# EAGLE design motorcomp (EAGLE 6.6.0)
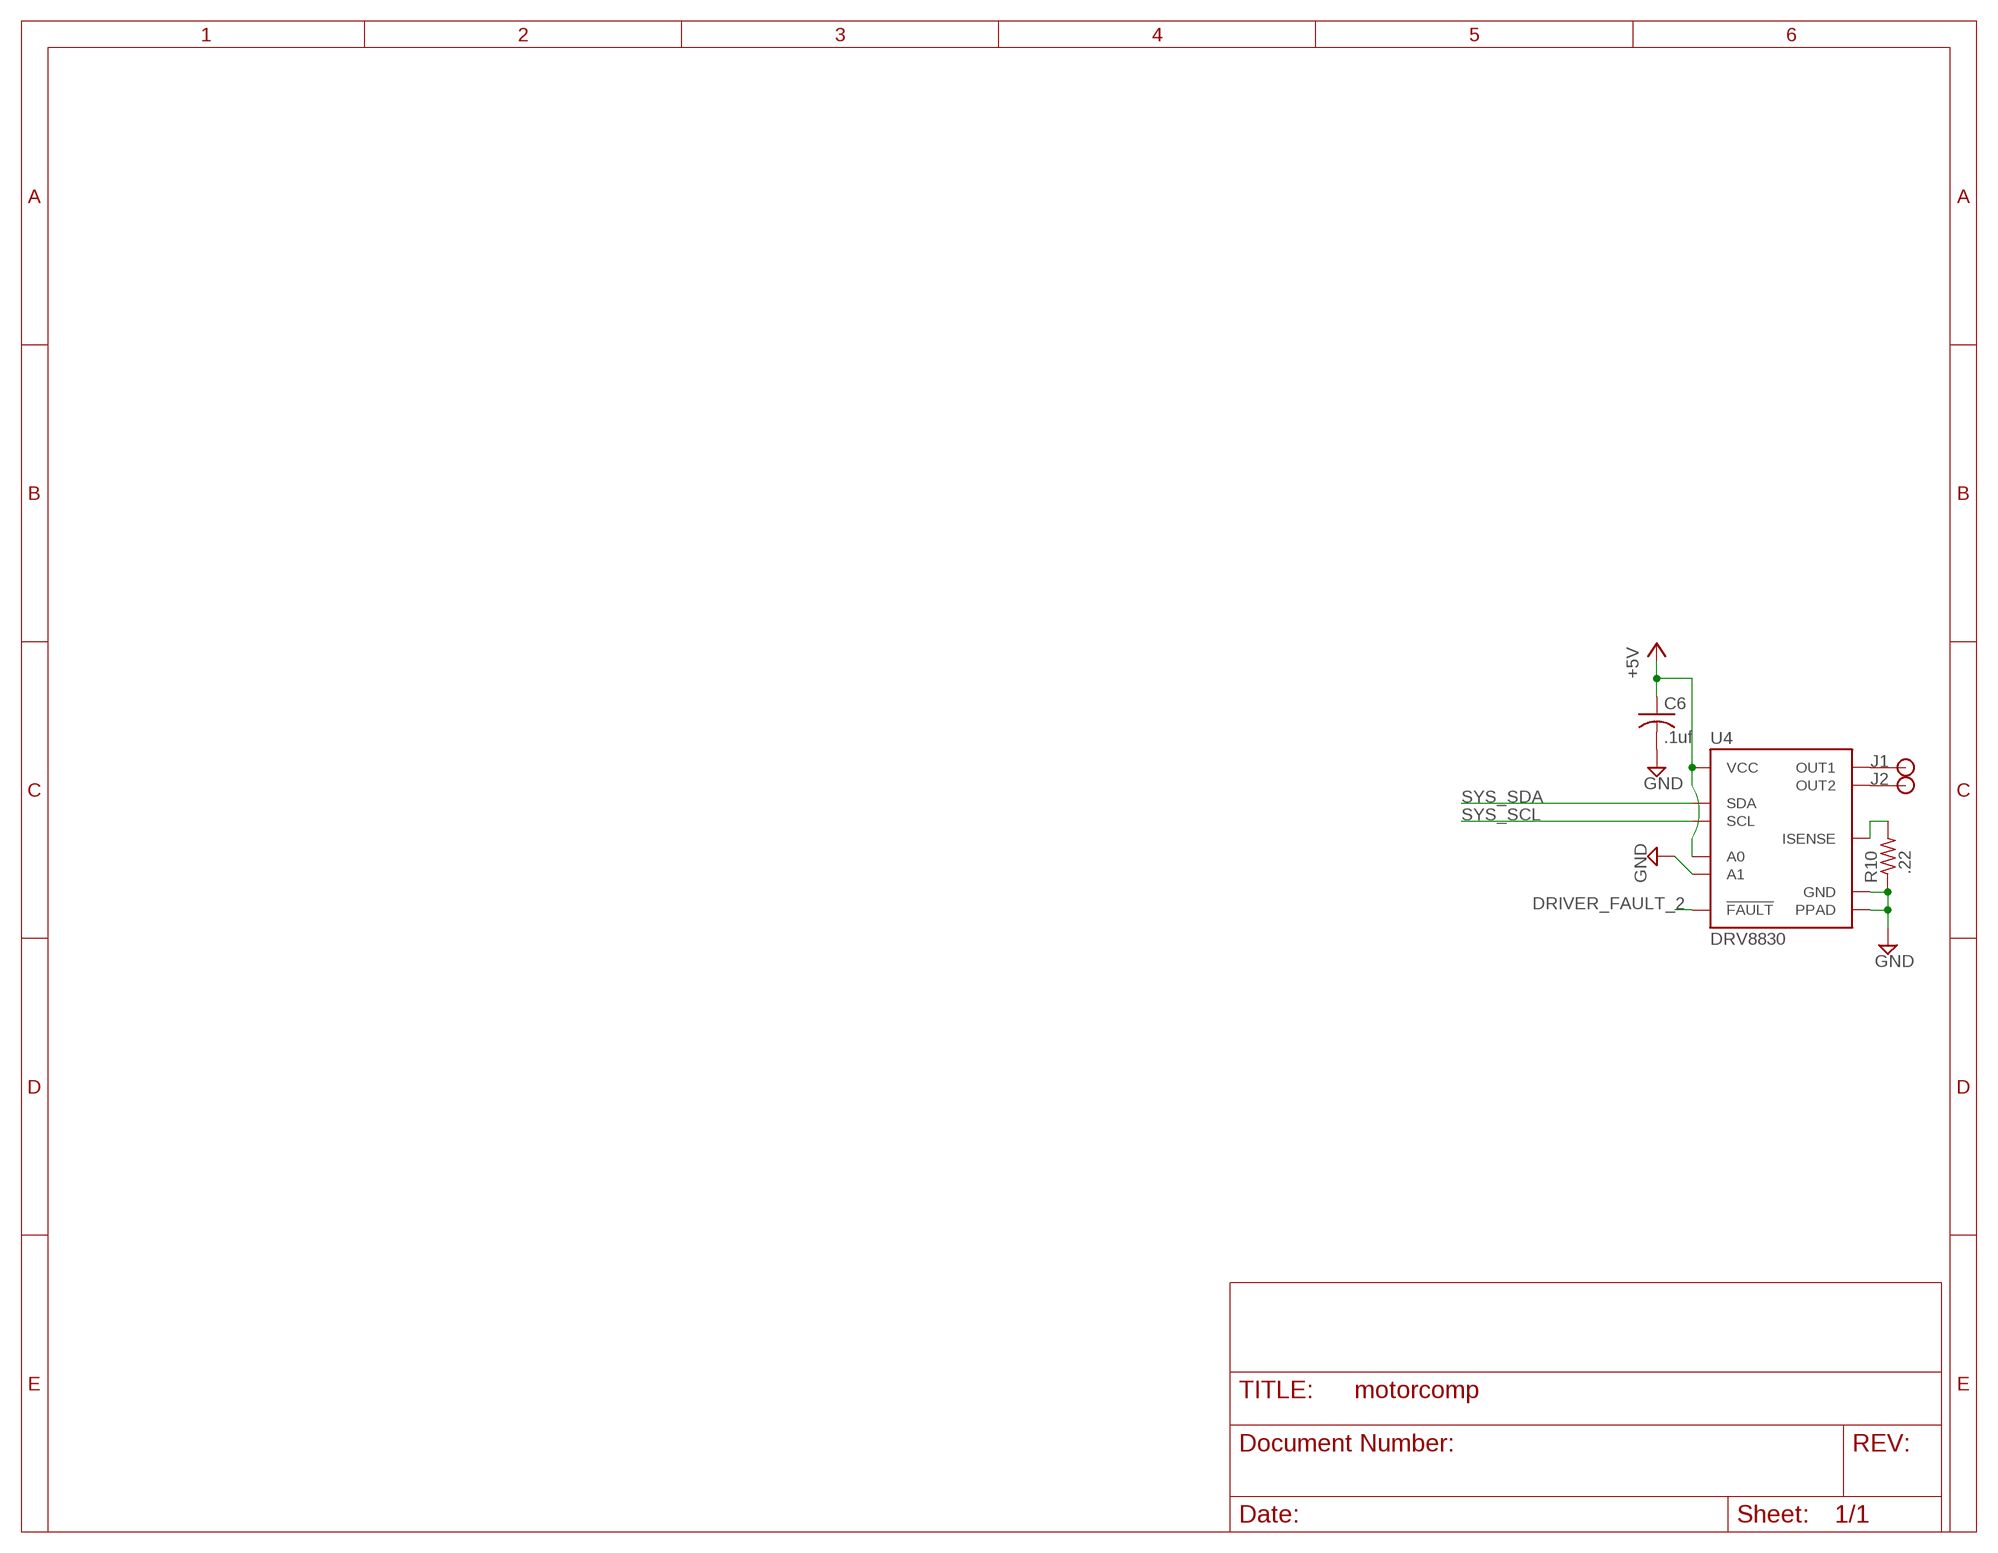
[diagram p0: schematic, sheet 1]

## Parts
C6  .1uf  C-USC0603  [C0603]
J1  2MMPAD  [2MMPAD]
J2  2MMPAD  [2MMPAD]
R10  .22  R-US_R0402  [R0402]
U4  DRV8830  [MSOP-10-GNDPAD]

## Nets
+5V: C6.1 U4.4(VCC) U4.7(A0)
DRIVER_FAULT_2: U4.6(!FAULT)
GND: C6.2 R10.1 U4.5(GND) U4.8(A1) U4.GND(PPAD)
N$6: J1.P$1 U4.3(OUT1)
N$10: J2.P$1 U4.1(OUT2)
N$19: R10.2 U4.2(ISENSE)
SYS_SCL: U4.10(SCL)
SYS_SDA: U4.9(SDA)

## Library data of the parts
C6 = rcl:C-US: CAPACITOR, American symbol
J1 J2 = connectors:2MMPAD
R10 = rcl:R-US_: RESISTOR, American symbol
U4 = SparkFun-PowerIC:DRV8830: DRV8830 I2C DC Motor Driver TSSOP-10 with exposed power pad 1A current limit, 2.75V to 6.8V; PROD_ID: IC-11646

## Board
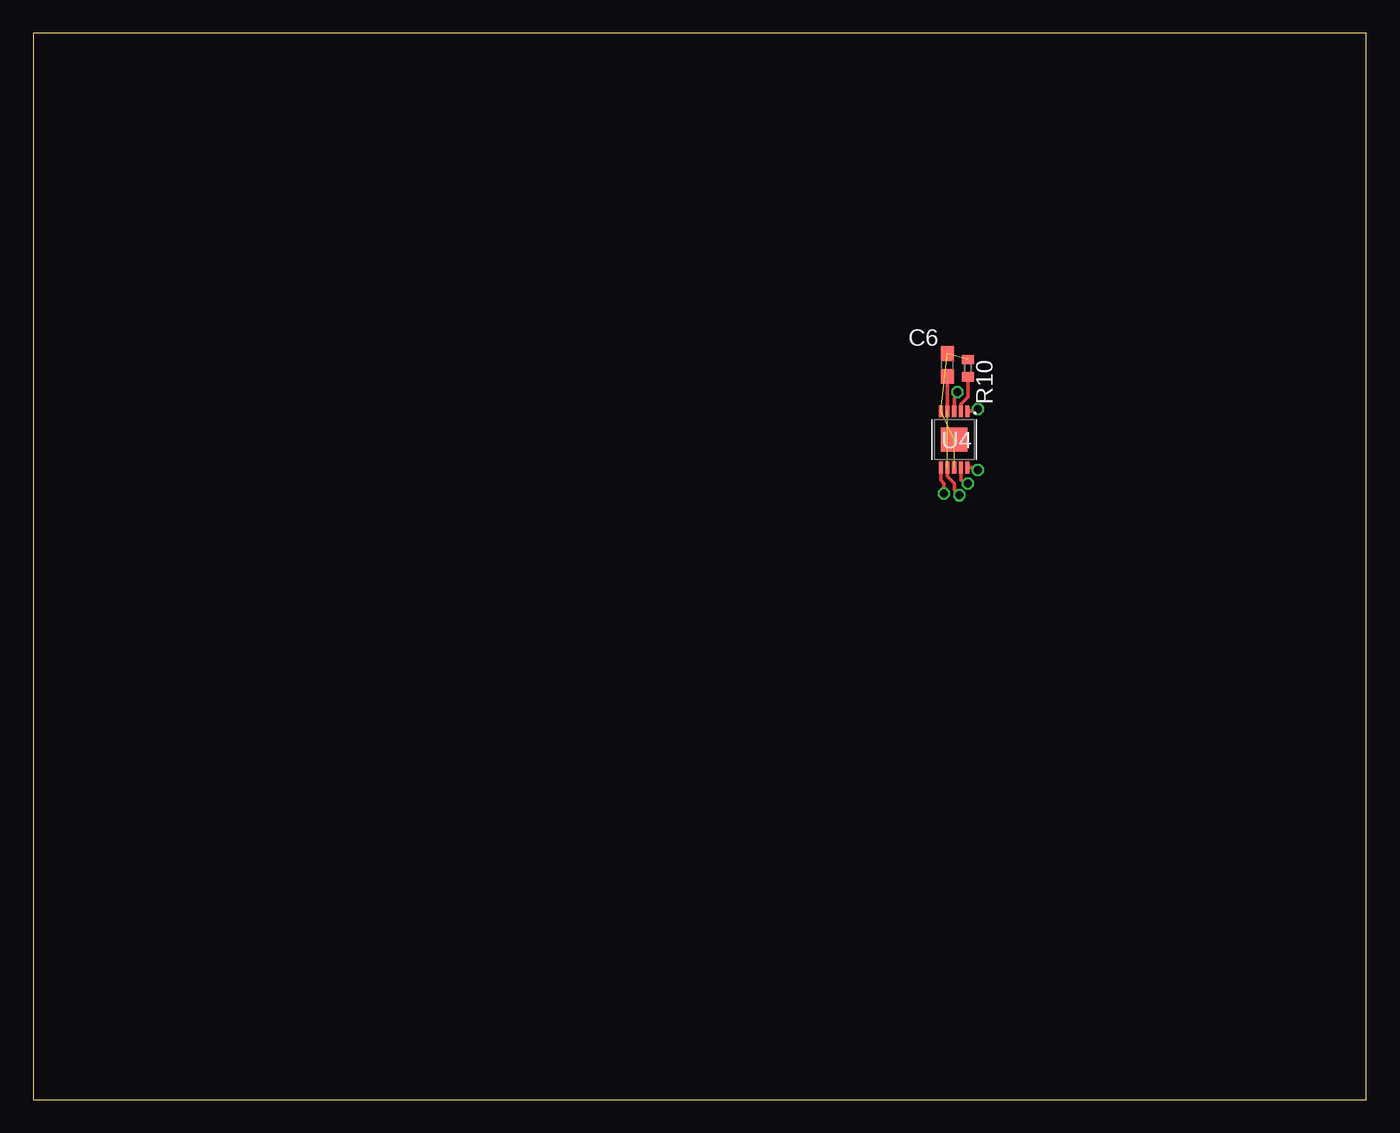
[diagram p1: board, top side]
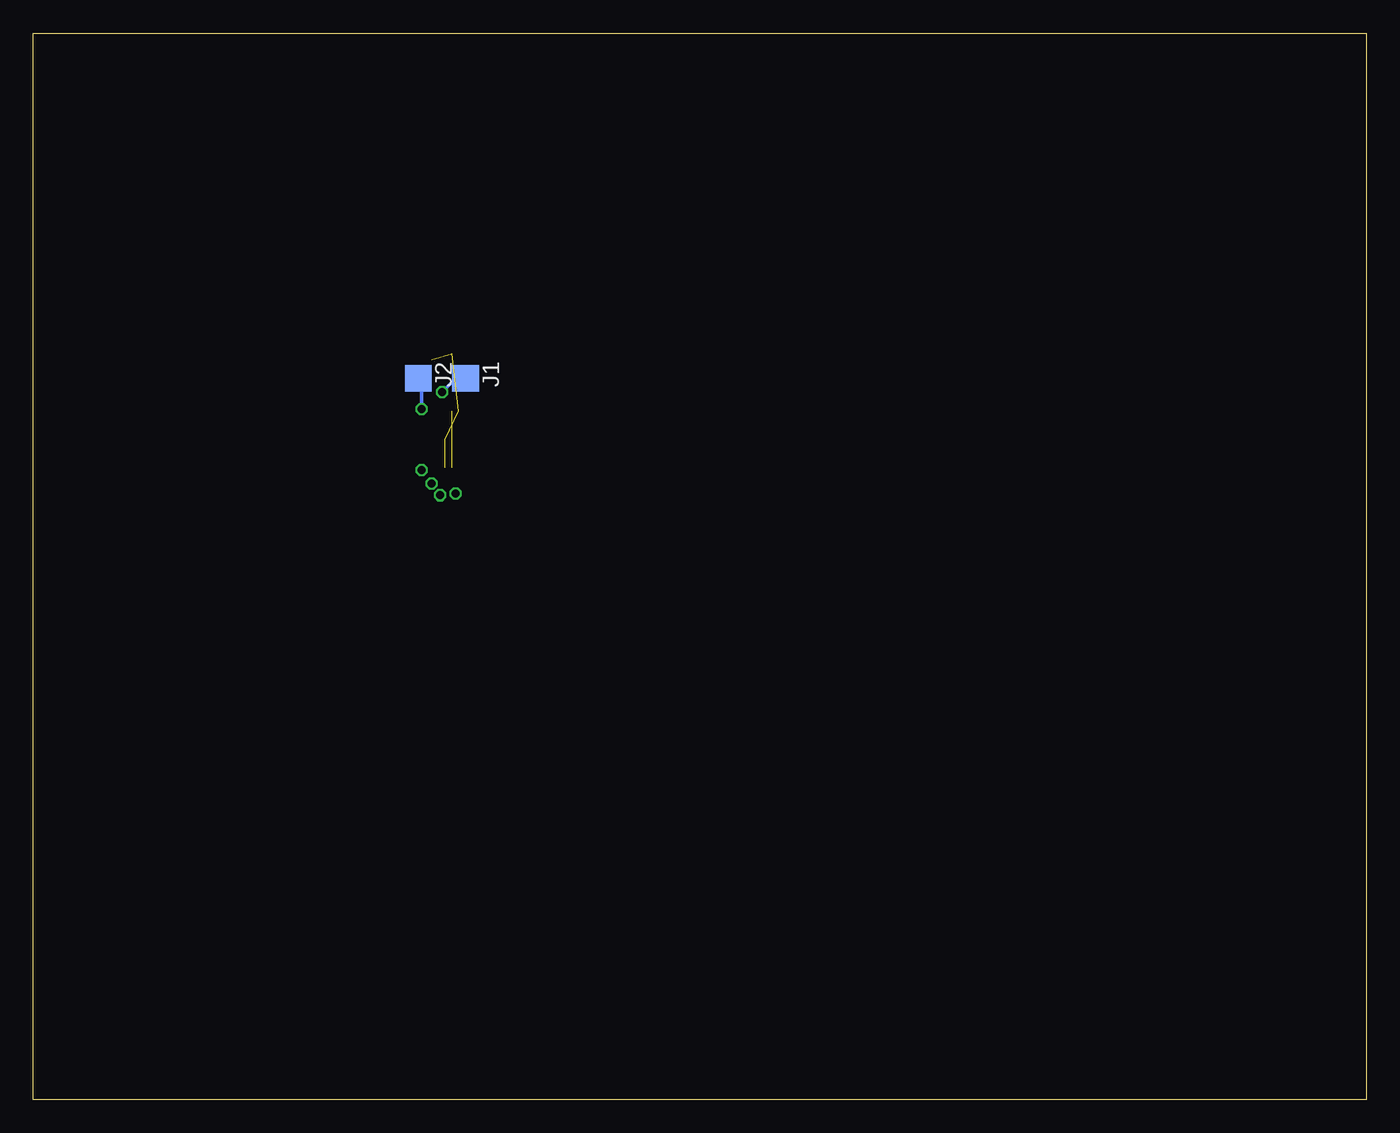
[diagram p2: board, bottom side, seen from below]

Size 100 x 80 mm. Coordinates in mm from the lower left corner, seen from the top.
Outline: 0,0 100,0 100,80 0,80 0,0
Copper layers (1*16): Top 0.035mm / dielectric 1.5mm / Bottom 0.035mm
Design rules "SeeedStudio_2layer_DRU_no_angle_20140221": minimum track width 6mil, minimum drill 12mil, track to track 6mil, track to pad 6mil, pad to pad 6mil, via to via 6mil, smd to smd 0mil, copper to edge 10mil, drill to drill 10mil, minimum pad ring 10mil, minimum via ring 6mil, stop-mask expansion 2mil, vias tented up to drill 100mil, thermal gap 10mil

### Footprints (pad centres in the part's own frame; a part is rotated, then mirrored left to right if it is on the bottom)
C0603 = smd 1.1 x 1: 1 -0.85,0; 2 0.85,0
2MMPAD = smd 2 x 2: P$1 0,0
R0402 = smd 0.7 x 0.9: 1 -0.65,0; 2 0.65,0
MSOP-10-GNDPAD = smd 0.305 x 0.889: 1 -1,-2.11; 2 -0.5,-2.11; 3 0,-2.11; 4 0.5,-2.11; 5 1,-2.11; 6 1,2.11; 7 0.5,2.11; 8 0,2.11; 9 -0.5,2.11; 10 -1,2.11 | smd 2 x 1.8: GND 0,0

### Placement (x,y rotation side)
C6  68.58,55.12 90 top
J1  67.56,54.1 270 bottom
J2  71.12,54.1 270 bottom
R10  70.1,54.86 270 top
U4  69.09,49.53 180 top

### Tracks (layer width: path | path; a pad name or v marks a point on that pad's centre or on a via)
+5V  (via drill 0.6)  (1 unrouted)
  Top 0.254: U4.7 68.59,46.73 69.09,46.23 69.09,45.72 v69.47,45.34 | U4.4 68.59,54.01 C6.1
DRIVER_FAULT_2  (via drill 0.6)
  Top 0.254: U4.6 68.09,46.47 68.33,46.23 v68.33,45.47
GND  (4 unrouted)
N$6  (via drill 0.6)
  Top 0.254: U4.3 69.09,52.58 v69.34,53.09
  Bottom 0.254: J1.P$1 68.33,54.1 v69.34,53.09
N$10  (via drill 0.6)
  Top 0.254: U4.1 70.69,51.64 v70.87,51.82
  Bottom 0.254: v70.87,51.82 70.87,53.85 J2.P$1
N$19
  Top 0.254: U4.2 69.59,52.19 70.1,52.7 R10.2
SYS_SCL  (via drill 0.6)
  Top 0.254: U4.10 70.69,47.42 v70.87,47.24
SYS_SDA  (via drill 0.6)
  Top 0.254: U4.9 69.59,46.49 v70.1,46.23